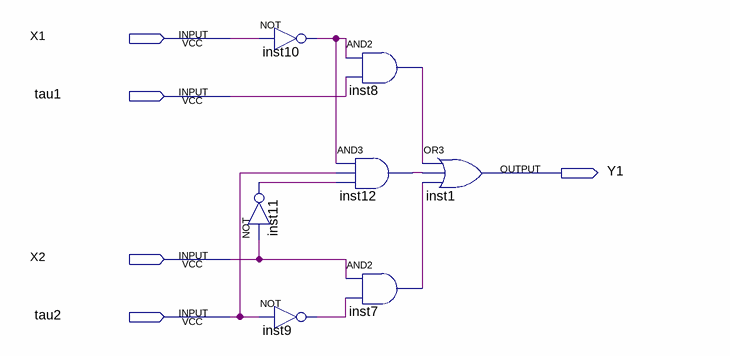
[diagram p0: schematic sheet]
// Quartus schematic Block5.bdf as structural Verilog: 7 symbols, 5 pins
module Block5 (
  input  X1,
  input  tau1,
  input  X2,
  input  tau2,
  output Y1
);

  wire inst7_out, inst8_out, inst9_out, inst10_out, inst11_out, inst12_out;

  not inst10 (inst10_out, X1);
  not inst11 (inst11_out, X2);
  not inst9 (inst9_out, tau2);
  and inst8 (inst8_out, inst10_out, tau1);
  and inst12 (inst12_out, inst10_out, tau2, inst11_out);
  and inst7 (inst7_out, X2, inst9_out);
  or inst1 (Y1, inst8_out, inst12_out, inst7_out);
endmodule
